# EAGLE design s2m (EAGLE 9.3.0)
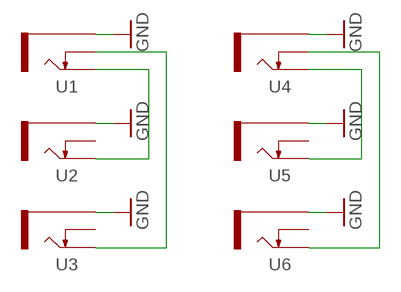
[diagram p0: schematic, sheet 1]

## Parts
U1  THONKICONNNEW  [WQP-PJ301M-12_JACK]
U2  THONKICONNNEW  [WQP-PJ301M-12_JACK]
U3  THONKICONNNEW  [WQP-PJ301M-12_JACK]
U4  THONKICONNNEW  [WQP-PJ301M-12_JACK]
U5  THONKICONNNEW  [WQP-PJ301M-12_JACK]
U6  THONKICONNNEW  [WQP-PJ301M-12_JACK]

## Nets
GND: U1.P$3_SLEEVE(SLEEVE) U2.P$3_SLEEVE(SLEEVE) U3.P$3_SLEEVE(SLEEVE) U4.P$3_SLEEVE(SLEEVE) U5.P$3_SLEEVE(SLEEVE) U6.P$3_SLEEVE(SLEEVE)
N$1: U1.P$2_SWITCH(SWITCH) U3.P$1_TIP(TIP)
N$2: U1.P$1_TIP(TIP) U2.P$1_TIP(TIP)
N$3: U4.P$2_SWITCH(SWITCH) U6.P$1_TIP(TIP)
N$4: U4.P$1_TIP(TIP) U5.P$1_TIP(TIP)
Unconnected: U2.P$2_SWITCH(SWITCH) U3.P$2_SWITCH(SWITCH) U5.P$2_SWITCH(SWITCH) U6.P$2_SWITCH(SWITCH)

## Library data of the parts
U1-U6 = MusicThingModular:THONKICONN: 3.5mm socket for Eurorack modular synths

## Board
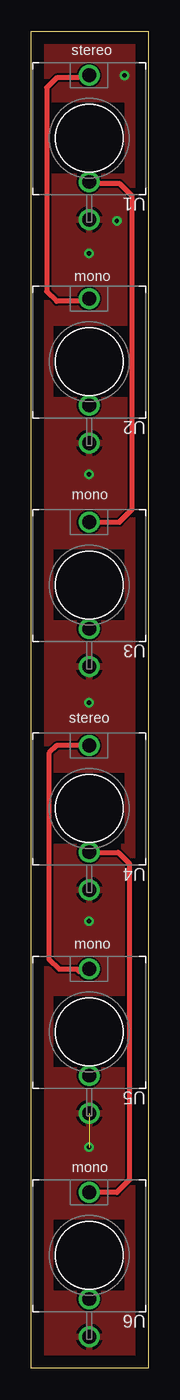
[diagram p1: board, top side]
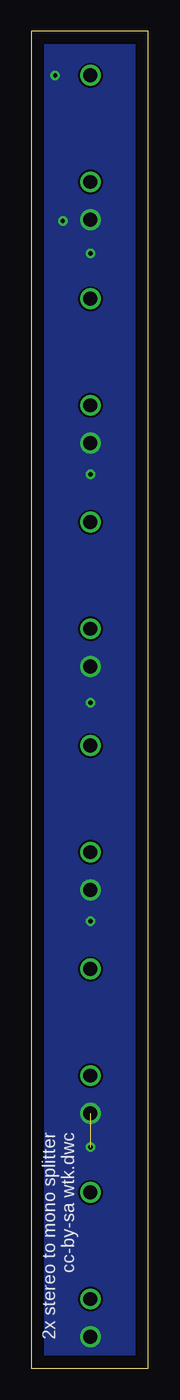
[diagram p2: board, bottom side, seen from below]

Size 9.3 x 106.5 mm. Coordinates in mm from the lower left corner, seen from the top.
Outline: 0,0 0,106.5 9.3,106.5 9.3,0 0,0
Copper layers (1*16): Top 0.035mm / dielectric 1.5mm / Bottom 0.035mm
Design rules "default": minimum track width 6mil, minimum drill 0.35mm, track to track 6mil, track to pad 6mil, pad to pad 6mil, via to via 6mil, smd to smd 6mil, copper to edge 40mil, drill to drill 6mil, minimum pad ring 10mil, minimum via ring 8mil, stop-mask expansion 4mil, vias tented up to drill 0mil, thermal gap 10mil

### Footprints (pad centres in the part's own frame; a part is rotated, then mirrored left to right if it is on the bottom)
WQP-PJ301M-12_JACK = drill 1.1: P$1_TIP 0,5; P$2_SWITCH 0,-3.5; P$3_SLEEVE 0,-6.5

### Placement (x,y rotation side)
U1  4.6,98 0 top
U2  4.6,80.2 0 top
U3  4.6,62.4 0 top
U4  4.6,44.6 0 top
U5  4.6,26.8 0 top
U6  4.6,9 0 top

### Tracks (layer width: path | path; a pad name or v marks a point on that pad's centre or on a via)
GND  (via drill 0.35)  (1 unrouted)
  other vias: 7.4,103 6.8,91.4 4.6,88.8 4.6,71.2 4.6,53 4.6,35.6 4.6,17.6
  pour Top: -6,110 -6,-5 16,-5 16,110
  pour Bottom (no thermals): -6,110.2 -6,-5 16,-5 16,110.2
N$1
  Top 0.406: U1.P$2_SWITCH 4.7,94.4 7,94.4 8,93.4 8,68.4 7,67.4 U3.P$1_TIP
N$2
  Top 0.406: U1.P$1_TIP 4.4,102.8 2,102.8 1.22,102.02 1.22,85.78 2,85 4.4,85 U2.P$1_TIP
N$3
  Top 0.406: U4.P$2_SWITCH 6.9,41.1 7.8,40.2 7.8,15 6.8,14 U6.P$1_TIP
N$4
  Top 0.406: U4.P$1_TIP 2,49.6 1.4,49 1.4,32.6 2.2,31.8 3.6,31.8 | 3.6,31.8 3.8,31.6 4,31.8 U5.P$1_TIP | 3.6,31.8 U5.P$1_TIP | U5.P$1_TIP 4.4,31.8

### Text on the board
tPlace: stereo | mono | mono | stereo | mono | mono
bPlace: 2x stereo to mono splitter / cc-by-sa wtk.dwc